# EAGLE schematic Plakat (EAGLE 7.5.0)
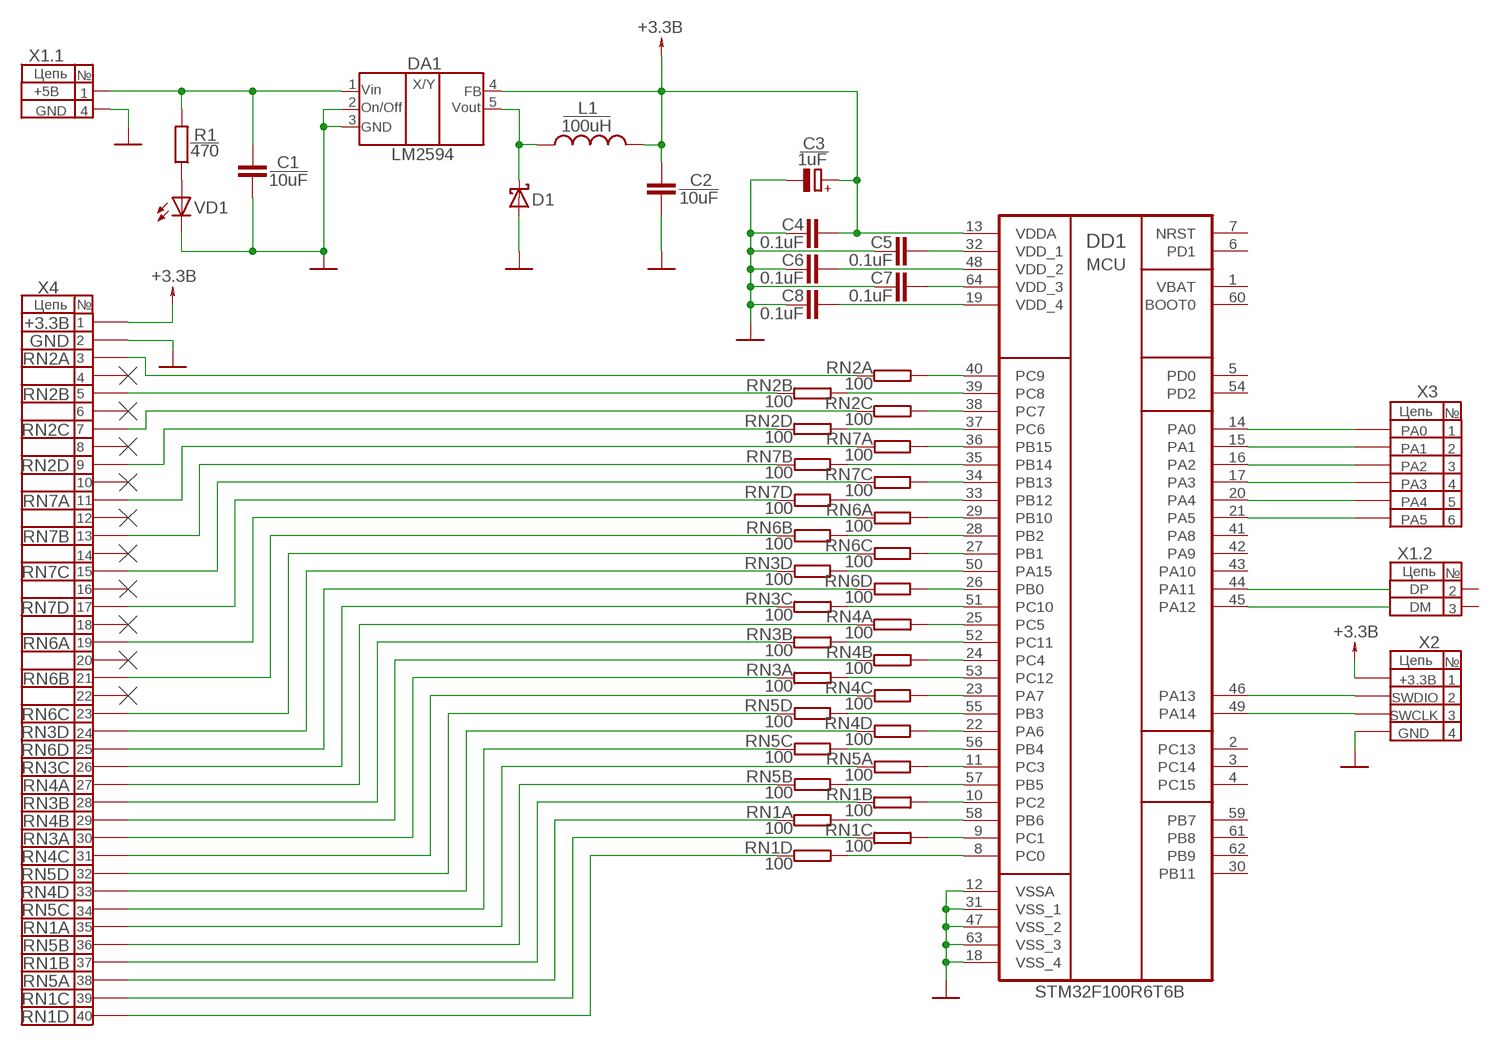
[diagram p0: schematic, sheet 1]

## Parts
C1  10uF  C-EUC0805  [C0805]
C2  10uF  C-EUC0805  [C0805]
C3  1uF  CPOL-EU  [TYPE_A_TECAP]
C4  0.1uF  C-EUC0805  [C0805]
C5  0.1uF  C-EUC0805  [C0805]
C6  0.1uF  C-EUC0805  [C0805]
C7  0.1uF  C-EUC0805  [C0805]
C8  0.1uF  C-EUC0805  [C0805]
D1  1N5819-T  [DO41-7.6]
DA1  LM2594  [LM2495]
DD1  STM32F100R6T6B  [QFP50P1200X1200X160-64N]
L1  100uH  SRD0604-101KL  [101KL]
R1  470  R  [R0805]
RN1  100  4R-N0603-ARC  [0603-ARC]
RN2  100  4R-N0603-ARC  [0603-ARC]
RN3  100  4R-N0603-ARC  [0603-ARC]
RN4  100  4R-N0603-ARC  [0603-ARC]
RN5  100  4R-N0603-ARC  [0603-ARC]
RN6  100  4R-N0603-ARC  [0603-ARC]
RN7  100  4R-N0603-ARC  [0603-ARC]
VD1  LED_E  [LED_1206]
X1.1  PINHD-1X2  [1X02]
X1.2  PINHD-1X2  [1X02]
X2  PINHD-1X4  [1X04]
X3  PINHD-1X6  [1X06]
X4  PINHD-2X20  [2X20]

## Nets
GND: C1.2 C2.2 C3.- C4.1 C5.1 C6.1 C7.1 C8.1 D1.A DA1.GND DA1.ON/OFF VD1.C X1.1.2 X2.4 X4.2
N$1: C1.1 DA1.V(IN) R1.2 X1.1.1
N$2: D1.C DA1.OUT L1.2
N$3: DD1.14(PA0) X3.1
N$4: R1.1 VD1.A
N$5: DD1.40(PC9) RN2.1
N$6: DD1.15(PA1) X3.2
N$7: DD1.39(PC8) RN2.2
N$8: DD1.16(PA2) X3.3
N$9: DD1.17(PA3) X3.4
N$10: DD1.20(PA4) X3.5
N$11: DD1.21(PA5) X3.6
N$12: DD1.38(PC7) RN2.3
N$13: DD1.37(PC6) RN2.4
N$14: DD1.36(PB15) RN7.8
N$15: DD1.35(PB14) RN7.7
N$16: DD1.34(PB13) RN7.6
N$17: DD1.33(PB12) RN7.5
N$18: DD1.29(PB10) RN6.8
N$19: DD1.28(PB2) RN6.7
N$20: DD1.27(PB1) RN6.6
N$21: DD1.50(PA15) RN3.5
N$22: DD1.26(PB0) RN6.5
N$23: DD1.51(PC10) RN3.3
N$24: DD1.25(PC5) RN4.1
N$25: DD1.52(PC11) RN3.2
N$26: DD1.24(PC4) RN4.2
N$27: DD1.53(PC12) RN3.1
N$28: DD1.23(PA7) RN4.6
N$29: DD1.55(PB3) RN5.5
N$30: C5.2 DD1.32(VDD_1)
N$31: DD1.22(PA6) RN4.5
N$32: DD1.56(PB4) RN5.6
N$33: DD1.11(PC3) RN5.8
N$34: DD1.57(PB5) RN5.7
N$35: DD1.10(PC2) RN1.2
N$36: DD1.58(PB6) RN1.1
N$37: DD1.9(PC1) RN1.3
N$38: DD1.8(PC0) RN1.4
N$39: RN2.8 X4.3
N$40: RN2.7 X4.5
N$41: RN2.6 X4.7
N$42: RN2.5 X4.9
N$43: RN7.1 X4.11
N$44: RN7.2 X4.13
N$45: RN7.3 X4.15
N$46: RN7.4 X4.17
N$47: RN6.1 X4.19
N$48: RN6.2 X4.21
N$49: RN6.3 X4.23
N$50: RN3.4 X4.24
N$51: RN6.4 X4.25
N$52: RN3.6 X4.26
N$53: RN4.8 X4.27
N$54: RN3.7 X4.28
N$55: RN4.7 X4.29
N$56: RN3.8 X4.30
N$57: RN4.3 X4.31
N$58: RN5.4 X4.32
N$59: RN4.4 X4.33
N$60: RN5.3 X4.34
N$61: RN5.1 X4.35
N$62: RN5.2 X4.36
N$63: RN1.7 X4.37
N$64: RN1.8 X4.38
N$65: RN1.6 X4.39
N$66: RN1.5 X4.40
N$67: DD1.44(PA11)
N$68: C7.2 DD1.64(VDD_3)
N$69: C6.2 DD1.48(VDD_2)
N$70: DD1.45(PA12)
N$71: C8.2 DD1.19(VDD_4)
SWCLK: DD1.49(PA14) X2.3
SWDIO: DD1.46(PA13) X2.2
VCC: C2.1 C3.+ C4.2 DA1.FB DD1.13(VDDA) L1.1 X2.1 X4.1 ; supply symbol labelled +3.3В
Unconnected: DD1.2(PC13) DD1.3(PC14) DD1.4(PC15) DD1.5(PD0) DD1.6(PD1) DD1.7(NRST) DD1.30(PB11) DD1.41(PA8) DD1.42(PA9) DD1.43(PA10) DD1.54(PD2) DD1.59(PB7) DD1.60(BOOT0) DD1.61(PB8) DD1.62(PB9) X1.2.1 X1.2.2 X4.4 X4.6 X4.8 X4.10 X4.12 X4.14 X4.16 X4.18 X4.20 X4.22

## Notes on the sheet
- Цепь | №
- 1 | 4
- +5В | 1 | Vin | FB
- 2 | 5
- GND | 4 | On/Off | Vout
- 3
- GND
- MCU
- +3.3В
- GND
- RN2A
- RN2B
- Цепь | №
- RN2C | PA0 | 1
- PA1 | 2
- RN2D | PA2 | 3
- PA3 | 4
- RN7A | PA4 | 5
- PA5 | 6
- RN7B
- RN7C | Цепь | №
- DP | 2
- RN7D | DM | 3
- RN6A
- Цепь | №
- RN6B | +3.3В | 1
- SWDIO | 2
- RN6C | SWCLK | 3
- RN3D | GND | 4
- RN6D
- RN3C
- RN4A
- RN3B
- RN4B
- RN3A
- RN4C
- RN5D
- RN4D
- RN5C
- RN1A
- RN5B
- RN1B
- RN5A
- STM32F100R6T6B
- RN1C
- RN1D

## Power pins joined to a net without a drawn wire
VBAT: DD1.1(VBAT)
VSS_1: DD1.31(VSS_1)
VSS_2: DD1.47(VSS_2)
VSS_3: DD1.63(VSS_3)
VSS_4: DD1.18(VSS_4)
VSSA: DD1.12(VSSA)

## Library data of the parts
C1 C2 C4-C8 = rcl:C-EU: CAPACITOR, European symbol
C3 = rcl:CPOL-EU: POLARIZED CAPACITOR, European symbol
D1 = diode:1N581*: 1.0A SCHOTTKY BARRIER RECTIFIER Source: http://www.diodes.com/datasheets/ds23001.pdf
DA1 = LM2594:LM2594
DD1 = ST Microelctronics_By_element14_Batch_1:STM32F100R6T6B: ARM-based 32-bit MCU; MPN: STM32F100R6T6B; OC_FARNELL: 1838506; OC_NEWARK: 76R0991; PACKAGE: QFP-64; SUPPLIER: STMICROELECTRONICS
L1 = BOURNS:SRD0604-101KL
R1 = eagle-ltspice:R: RESISTOR, European symbol; SPICEMODEL: NONE; SPICEPREFIX: R
RN1-RN7 = resistor-dil:4R-N: Array Chip Resistor Source: RS Component / Phycomp; OC_FARNELL: unknown; OC_NEWARK: unknown
VD1 = eagle-ltspice:LED_E: LED Source: http://www.osram.convergy.de Source: www.luxeon.com Source: www.kingbright.com; SPICEMODEL: NONE; SPICEPREFIX: D; SPICETYPE: diode
X1.1 X1.2 = pinhead:PINHD-1X2: PIN HEADER
X2 = pinhead:PINHD-1X4: PIN HEADER
X3 = pinhead:PINHD-1X6: PIN HEADER
X4 = pinhead:PINHD-2X20: PIN HEADER